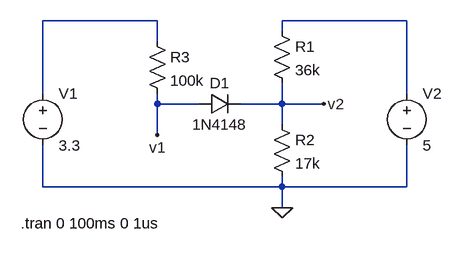
[diagram p0: schematic Draft1.asc]
Draft1.asc, the LTspice schematic file:
Version 4
SHEET 1 880 680
WIRE 96 48 -80 48
WIRE 480 48 288 48
WIRE 288 64 288 48
WIRE 96 80 96 48
WIRE -80 160 -80 48
WIRE 480 160 480 48
WIRE 96 176 96 160
WIRE 160 176 96 176
WIRE 288 176 288 144
WIRE 288 176 224 176
WIRE 352 176 288 176
WIRE 288 208 288 176
WIRE 96 224 96 176
WIRE -80 304 -80 240
WIRE 288 304 288 288
WIRE 288 304 -80 304
WIRE 480 304 480 240
WIRE 480 304 288 304
WIRE 288 336 288 304
FLAG 288 336 0
FLAG 96 224 v1
FLAG 352 176 v2
SYMBOL res 272 48 R0
SYMATTR InstName R1
SYMATTR Value 36k
SYMBOL res 272 192 R0
SYMATTR InstName R2
SYMATTR Value 17k
SYMBOL voltage -80 144 R0
SYMATTR InstName V1
SYMATTR Value 3.3
SYMBOL voltage 480 144 R0
SYMATTR InstName V2
SYMATTR Value 5
SYMBOL diode 160 192 R270
WINDOW 0 32 32 VTop 2
WINDOW 3 0 32 VBottom 2
SYMATTR InstName D1
SYMATTR Value 1N4148
SYMBOL res 80 64 R0
SYMATTR InstName R3
SYMATTR Value 100k
TEXT -114 360 Left 2 !.tran 0 100ms 0 1us

The netlist it stands for:
* Draft1.asc
R1 N002 v2 36k
R2 v2 0 17k
V1 N001 0 3.3
V2 N002 0 5
D1 v1 v2 1N4148
R3 N001 v1 100k
.model D D
.lib standard.dio
.tran 0 100ms 0 1us
.backanno
.end